# Altium schematic sheet DeltaSigma12.SchDoc: LiveDesign Evaluation - Countdown
size A4; Organization: Altium Limited; Address1: L3, 12a Rodborough Rd; Address2: Frenchs Forest; Address3: NSW; Address4: Australia 2086; DocumentNumber: 3; SheetNumber: 3; SheetTotal: 11
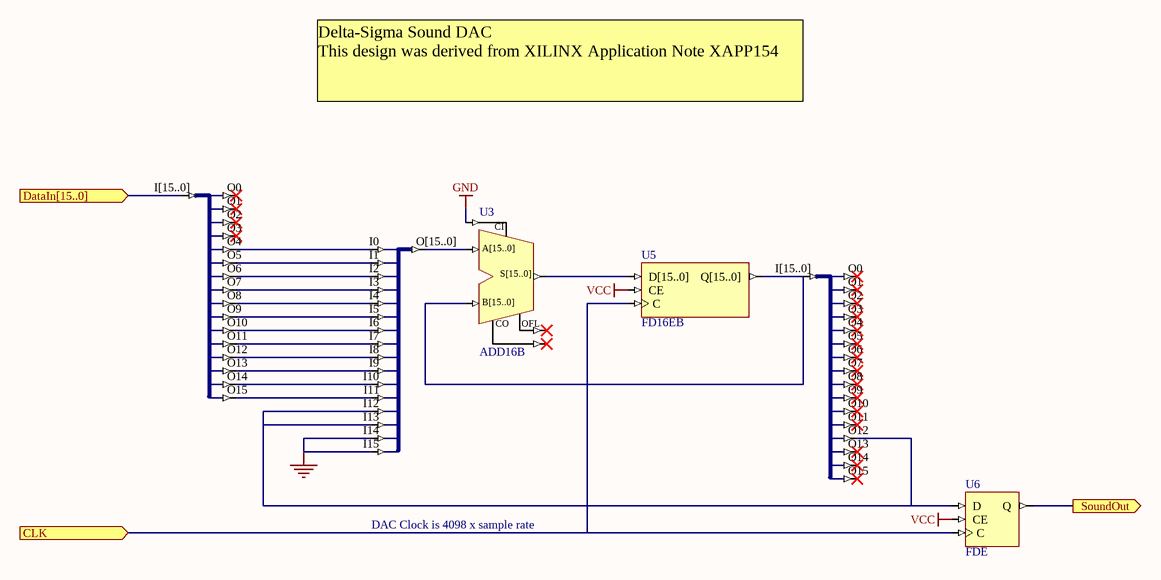
[diagram p0: DeltaSigma12.SchDoc]

## Parts
U1  J16B_16S  (value not drawn)
U2  J16B_16S  (value not drawn)
U3  ADD16B
U4  J16S_16B  (value not drawn)
U5  FD16EB
U6  FDE

## Ports
CLK (in), DataIn[15..0] (in), SoundOut (out)

## Nets
GND: U3.CI U4.I14 U4.I15
VCC: U5.CE U6.CE
CLK: U5.C U6.C ; port CLK
DataIn[15..0]: U1.I[15..0] ; port DataIn[15..0]
SoundOut: U6.Q ; port SoundOut
NetU1_O4: U1.O4 U4.I0
NetU1_O5: U1.O5 U4.I1
NetU1_O6: U1.O6 U4.I2
NetU1_O7: U1.O7 U4.I3
NetU1_O8: U1.O8 U4.I4
NetU1_O9: U1.O9 U4.I5
NetU1_O10: U1.O10 U4.I6
NetU1_O11: U1.O11 U4.I7
NetU1_O12: U1.O12 U4.I8
NetU1_O13: U1.O13 U4.I9
NetU1_O14: U1.O14 U4.I10
NetU1_O15: U1.O15 U4.I11
NetU2_I[15..0]: U2.I[15..0] U3.B[15..0] U5.Q[15..0]
NetU2_O12: U2.O12 U4.I12 U4.I13 U6.D
NetU3_A[15..0]: U3.A[15..0] U4.O[15..0]
NetU3_S[15..0]: U3.S[15..0] U5.D[15..0]

Not connected (* = marked no-connect by the designer): U1 O0* O1* O2* O3*; U2 O0* O1* O2* O3* O4* O5* O6* O7* O8* O9* O10* O11* O13* O14* O15*; U3 CO* OFL*

## Notes on the sheet
- Delta-Sigma Sound DAC
  This design was derived from XILINX Application Note XAPP154
- DAC Clock is 4098 x sample rate
- Title
- Size:
- Date:
- A4
- Number:
- Time:
- Revision:
- Sheet
- of
- File:

## Library data of the parts
U1 U2 = J16B_16S: Single 16-Bit input bus to 16 single pin outputs; ArchiveName: GENERIC; VHDLIB_SIM: GENERIC_LIB; Published: 29-Jan-2004; Publisher: Altium Limited; Core Revision: 1.00.00
U3 = ADD16B: 16-Bit Cascadable Full Adder with Signed and Unsigned Operations, Bus Version; Xilinx Equivalent: ADD16; ArchiveName: GENERIC; VHDLIB_SIM: GENERIC_LIB; Published: 29-Jan-2004; Publisher: Altium Limited; Core Revision: 1.00.00
U4 = J16S_16B: 16 Single pin inputs to single 16-Bit output bus; ArchiveName: GENERIC; VHDLIB_SIM: GENERIC_LIB; Published: 29-Jan-2004; Publisher: Altium Limited; Core Revision: 1.00.00
U5 = FD16EB: 16-Bit D Flip-Flop with Clock Enable, Bus Version; ArchiveName: GENERIC; VHDLIB_SIM: GENERIC_LIB; Published: 29-Jan-2004; Publisher: Altium Limited; Core Revision: 1.00.00
U6 = FDE: D Flip-Flop with Clock Enable; ArchiveName: GENERIC; VHDLIB_SIM: GENERIC_LIB; Published: 29-Jan-2004; Publisher: Altium Limited; Core Revision: 1.00.00